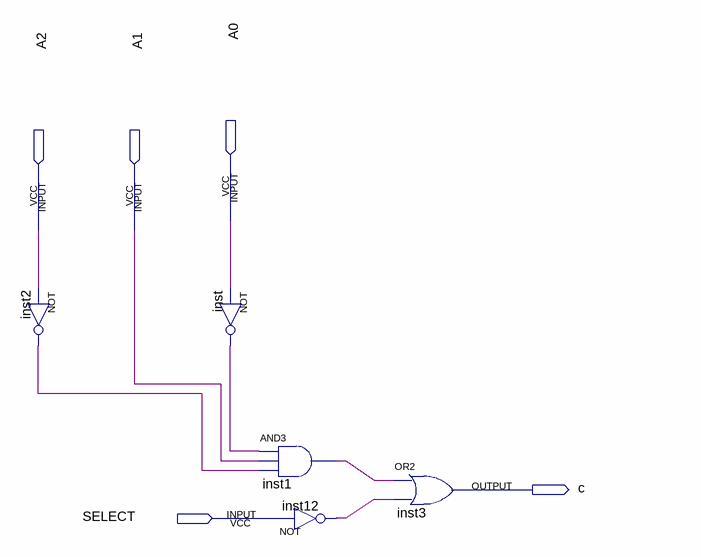
[diagram p0: schematic sheet]
// Quartus schematic segment_c.bdf as structural Verilog: 5 symbols, 5 pins
module segment_c (
  input  A0,
  input  A2,
  input  A1,
  input  SELECT,
  output c
);

  wire inst1_out, inst2_out, inst12_out, inst_out;

  not inst2 (inst2_out, A2);
  not inst (inst_out, A0);
  and inst1 (inst1_out, inst_out, A1, inst2_out);
  not inst12 (inst12_out, SELECT);
  or inst3 (c, inst1_out, inst12_out);
endmodule
